# Altium project SDC_V3.0.PrjPcb (part 2 of 2)

## Sheet RS_IF.SchDoc
size 420 x 297 mm; SheetNumber: 6; PageSetup: Record=PageOptions|CenterHorizontal=False|CenterVertical=False|PrintScale=0.95|XCorrection=0.00|YCorrection=0.00|PrintKind=1|BorderSize=5000000|LeftOffset=0|BottomOffset=0|Orientation=1|PaperLength=1000|PaperWidth=1000|Scale=100|PaperSource=15|PrintQuality=600|MediaType=1|DitherType=10|PaperKind=A4|PrintScaleMode=1
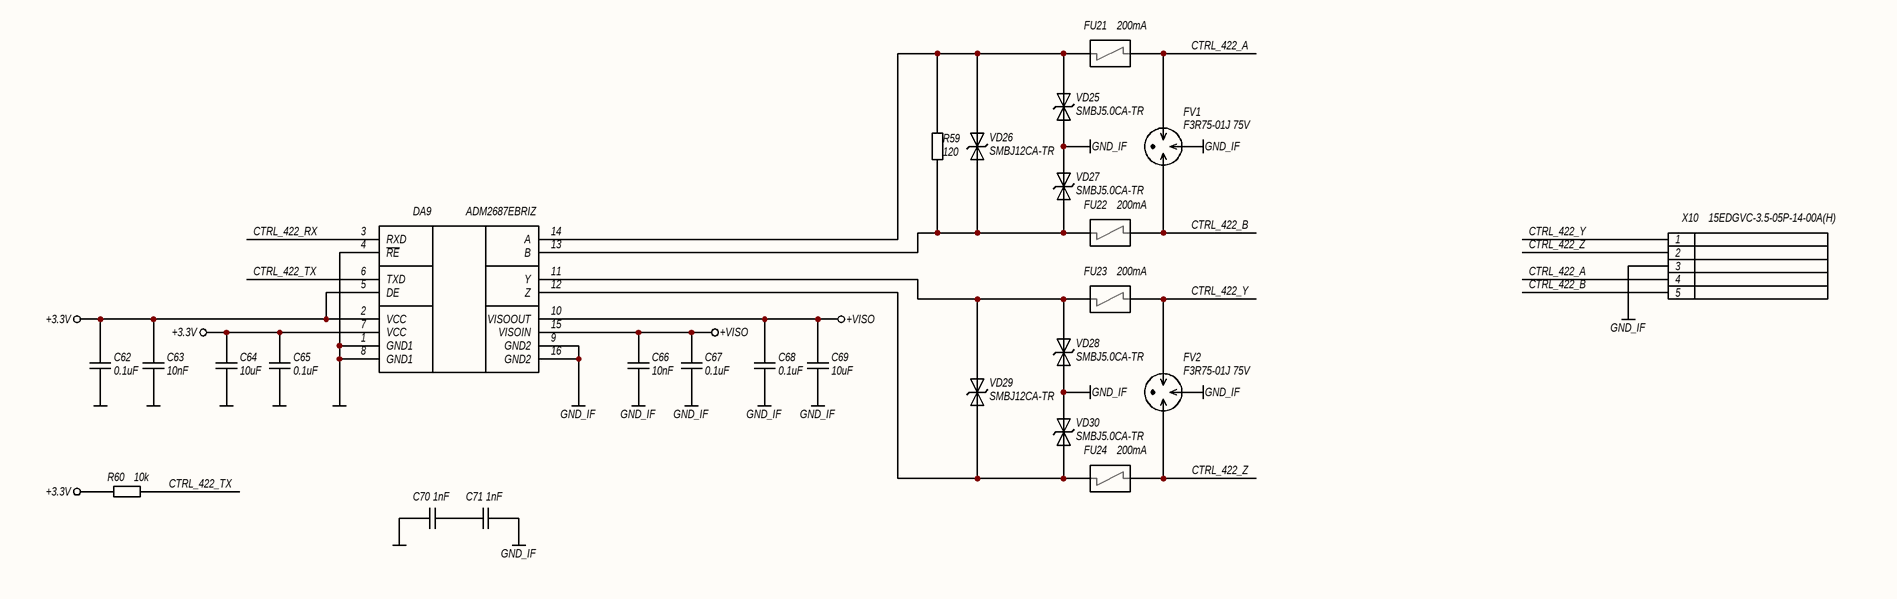
[diagram p5: RS_IF.SchDoc]

### Parts
C62  0.1uF  [C0603N]
C63  10nF  [C0603N]
C64  10uF  [C0805N]
C65  0.1uF  [C0603N]
C66  10nF  [C0603N]
C67  0.1uF  [C0603N]
C68  0.1uF  [C0603N]
C69  10uF  [C0805N]
C70  1nF  [C1808N]
C71  1nF  [C1808N]
DA9  ADM2687EBRIZ  [SOIC16_IC]
FU21  200mA  [TBU-CA]
FU22  200mA  [TBU-CA]
FU23  200mA  [TBU-CA]
FU24  200mA  [TBU-CA]
FV1  F3R75-01J 75V  [GDT_3PIN_B2]
FV2  F3R75-01J 75V  [GDT_3PIN_B2]
R59  120  [R0805N]
R60  10k  [R0603N]
VD25  SMBJ5.0CA-TR  [SMB]
VD26  SMBJ12CA-TR  [SMB]
VD27  SMBJ5.0CA-TR  [SMB]
VD28  SMBJ5.0CA-TR  [SMB]
VD29  SMBJ12CA-TR  [SMB]
VD30  SMBJ5.0CA-TR  [SMB]
X10  15EDGVC-3.5-05P-14-00A(H)  [15EDGVC-3.5-05P-14-00A(H)]

### Nets
+3.3V: C62.2 C63.1 C64.2 C65.2 DA9.2(VCC) DA9.5(DE) DA9.7(VCC) R60.2
+VISO: C66.1 C67.2 C68.2 C69.2 DA9.10(VISOOUT) DA9.15(VISOIN)
GND: C62.1 C63.2 C64.1 C65.1 C70.2 DA9.1(GND1) DA9.4(~{RE}) DA9.8(GND1)
GND_IF: C66.2 C67.1 C68.1 C69.1 C71.1 DA9.9(GND2) DA9.16(GND2) FV1.2 FV2.2 VD25.2(A2) VD27.2(A2) VD28.2(A2) VD30.2(A2) X10.3
CTRL_422_A: FU21.3(IN/OUT) FV1.1 X10.4
CTRL_422_B: FU22.3(IN/OUT) FV1.3 X10.5
CTRL_422_RX: DA9.3(RXD)
CTRL_422_TX: DA9.6(TXD) R60.1
CTRL_422_Y: FU23.3(IN/OUT) FV2.1 X10.1
CTRL_422_Z: FU24.3(IN/OUT) FV2.3 X10.2
NetC70_1: C70.1 C71.2
NetDA9_11: DA9.11(Y) FU23.1(IN/OUT) VD28.1(A1) VD29.1(A1)
NetDA9_12: DA9.12(Z) FU24.1(IN/OUT) VD29.2(A2) VD30.1(A1)
NetDA9_13: DA9.13(B) FU22.1(IN/OUT) R59.2 VD26.2(A2) VD27.1(A1)
NetDA9_14: DA9.14(A) FU21.1(IN/OUT) R59.1 VD25.1(A1) VD26.1(A1)

### Notes on the sheet
- Подп. и дата
- Инв. № дубл.
- Взам. инв. №
- Инв. № подл.
- Лист
- Изм.
- № докум.
- Подп.
- Дата
- Копировал
- Формат А3

### Library data of the parts
C62 C65 C67 C68 = CL10B104KB8NNNC: as C3 on sheet MCU; Артикул: CL10B104KB8NNNC; Номинал: 0.1uF; Строка для документации: https://mm.digikey.com/Volume0/opasdata/d220001/medias/docus/609/CL10B104KB8NNNC_Spec.pdf; Тип элемента: Конденсатор
C63 C66 = CL10B103KB8NNNC: as C29 on sheet DRIVER_A; Артикул: CL10B103KB8NNNC; Номинал: 10nF; Строка для документации: https://mm.digikey.com/Volume0/opasdata/d220001/medias/docus/609/CL10B103KB8NNNC_Spec.pdf; Тип элемента: Конденсатор
C64 C69 = CL21A106KAYNNNE: Конденсатор; Точность: 10%; Напряжение: 25V; Диэлектрик: X5R; Производитель: Samsung Electro-Mechanics; Описание: 10 µF ±10% 25V Ceramic Capacitor X5R 0805 (2012 Metric); Корпус: 0805 (2012 Metric); Температурный диапазон: -55°C ~ 85°C; Вид монтажа: SMD; Артикул: CL21A106KAYNNNE; Номинал: 10uF; Строка для документации: https://mm.digikey.com/Volume0/opasdata/d220001/medias/docus/5545/CL21A106KAYNNNE%20Spec.pdf; Тип элемента: Конденсатор
C70 C71 = GA342DR7GF102KW02L: Конденсатор; Точность: 10%; Напряжение: 250VAC; Диэлектрик: X7R; Производитель: Murata Electronics; Описание: 1000 pF ±10% 250VAC Ceramic Capacitor X7R 1808 (4520 Metric); Корпус: 1808 (4520 Metric); Температурный диапазон: -55°C ~ 125°C; Вид монтажа: SMD; Артикул: GA342DR7GF102KW02L; Номинал: 1nF; Строка для документации: https://search.murata.co.jp/Ceramy/image/img/A01X/G101/ENG/GA342DR7GF102KW02-01.pdf; Тип элемента: Конденсатор
DA9 = ADM2687EBRIZ: Микросхема интерфейса RS485; Производитель: Analog Devices Inc.; Описание: RS422, RS485 Digital Isolator 5000Vrms 3 Channel 500kbps 25kV/µs CMTI 16-SOIC (0.295", 7.50mm Width); Корпус: 16-SOIC (0.295", 7.50mm Width); Температурный диапазон: -40°C ~ 85°C; Вид монтажа: SMD; Артикул: ADM2687EBRIZ; Строка для документации: https://www.analog.com/media/en/technical-documentation/data-sheets/ADM2682E_2687E.pdf; Тип элемента: Микросхема
FU21-FU24 = TBU-CA065-200-WH: Полупроводниковый предохранитель; Напряжение: 650V; Тип: Surge Suppression IС; Производитель: Bourns Inc.; Описание: SURGE SUPP TBU 200MA 650VIMP SMD; Корпус: 6.50mm x 4.00mm; Температурный диапазон: -55°C ~ 125°C; Вид монтажа: SMD; Артикул: TBU-CA065-200-WH; Ток: 200mA; Строка для документации: https://www.bourns.com/docs/Product-Datasheets/TBU-CA.pdf; Тип элемента: Предохранитель
FV1 FV2 = F3R75-01J 75V: Газовый разрядник, трехвыводный; Ток: 10kA; Тип: Gas Discharge Tube Arresters (GDT); Производитель: ZF; Описание: Gas Discharge Tube 75 V 10000A (10kA) ±25% 3 Pole Through Hole Mount; Корпус: 11.5mm x 7.5mm dia.; Вид монтажа: Through hole; Артикул: F3R75-01J 75V; Напряжение пробоя: 75V; Строка для документации: http://nbruitian.com/show.asp?id=1412; Тип элемента: Газовый разрядник
R59 = RC0805FR-07120RL: Резистор; Точность: 1%; ТКС: ±100ppm/°C; Напряжение: 150V; Производитель: YAGEO; Описание: 120 Ohms ±1% 0.125W, 1/8W Chip Resistor 0805 (2012 Metric) Moisture Resistant Thick Film; Корпус: 0805 (2012 Metric); Температурный диапазон: -55°C ~ 155°C; Вид монтажа: SMD; Артикул: RC0805FR-07120RL; Номинал: 120; Строка для документации: https://www.yageo.com/upload/media/product/productsearch/datasheet/rchip/PYu-RC_Group_51_RoHS_L_12.pdf; Тип элемента: Резистор
R60 = RC0603FR-0710KL: as R4 on sheet MCU; Артикул: RC0603FR-0710KL; Номинал: 10k; Строка для документации: https://www.yageo.com/upload/media/product/app/datasheet/rchip/pyu-rc_group_51_rohs_l.pdf; Тип элемента: Резистор
VD25 VD27 VD28 VD30 = SMBJ5.0CA-TR: TVS диод двунаправленный; Напряжение: 5V; Напряжение ограничения: 9.2V; Напряжение пробоя: 6.4V; Ток: 68A; Тип: TVS Bidirectional; Производитель: STMicroelectronics; Описание: 9.2V Clamp 68A Ipp Tvs Diode Surface Mount SMB (DO-214AA); Корпус: DO-214AA, SMB; Температурный диапазон: -55°C ~ 150°C (TJ); Вид монтажа: SMD; Тип элемента: Диод защитный; Артикул: SMBJ5.0CA-TR; Строка для документации: https://www.st.com/content/ccc/resource/technical/document/datasheet/19/78/91/39/07/cd/40/65/CD00001366.pdf/files/CD00001366.pdf/_jcr_content/translations/en.CD00001366.pdf
VD26 VD29 = SMBJ12CA-TR: TVS диод двунаправленный; Напряжение: 12V; Напряжение ограничения: 19.9V; Напряжение пробоя: 13.3V; Ток: 31A; Тип: TVS Bidirectional; Производитель: STMicroelectronics; Описание: 19.9V Clamp 31A Ipp Tvs Diode Surface Mount SMB (DO-214AA); Корпус: DO-214AA, SMB; Температурный диапазон: -55°C ~ 150°C (TJ); Вид монтажа: SMD; Тип элемента: Диод защитный; Артикул: SMBJ12CA-TR; Строка для документации: https://www.st.com/content/ccc/resource/technical/document/datasheet/19/78/91/39/07/cd/40/65/CD00001366.pdf/files/CD00001366.pdf/_jcr_content/translations/en.CD00001366.pdf
X10 = 15EDGVC-3.5-05P-14-00A(H): Разъем, 5 контактов; Тип разъема: Pluggable terminal block; Количество контактов: 5; Шаг контактов: 3.5mm; Ток: 7A; Напряжение: 250V; Производитель: Degson Electronics; Описание: Pluggable terminal block; 3.5mm; ways: 5; straight; socket; male; Температурный диапазон: -40°C ~ 105°C; Вид монтажа: Through Hole; Артикул: 15EDGVC-3.5-05P-14-00A(H); Строка для документации: https://www.tme.eu/Document/83e7173fe653a2d0e44585e87978945b/opr014R8.pdf; Тип элемента: Разъем

## Sheet POWER.SchDoc
size 420 x 297 mm; SheetNumber: 7; PageSetup: Record=PageOptions|CenterHorizontal=False|CenterVertical=False|PrintScale=0.95|XCorrection=0.00|YCorrection=0.00|PrintKind=1|BorderSize=5000000|LeftOffset=0|BottomOffset=0|Orientation=1|PaperLength=1000|PaperWidth=1000|Scale=100|PaperSource=15|PrintQuality=600|MediaType=1|DitherType=10|PaperKind=A4|PrintScaleMode=1
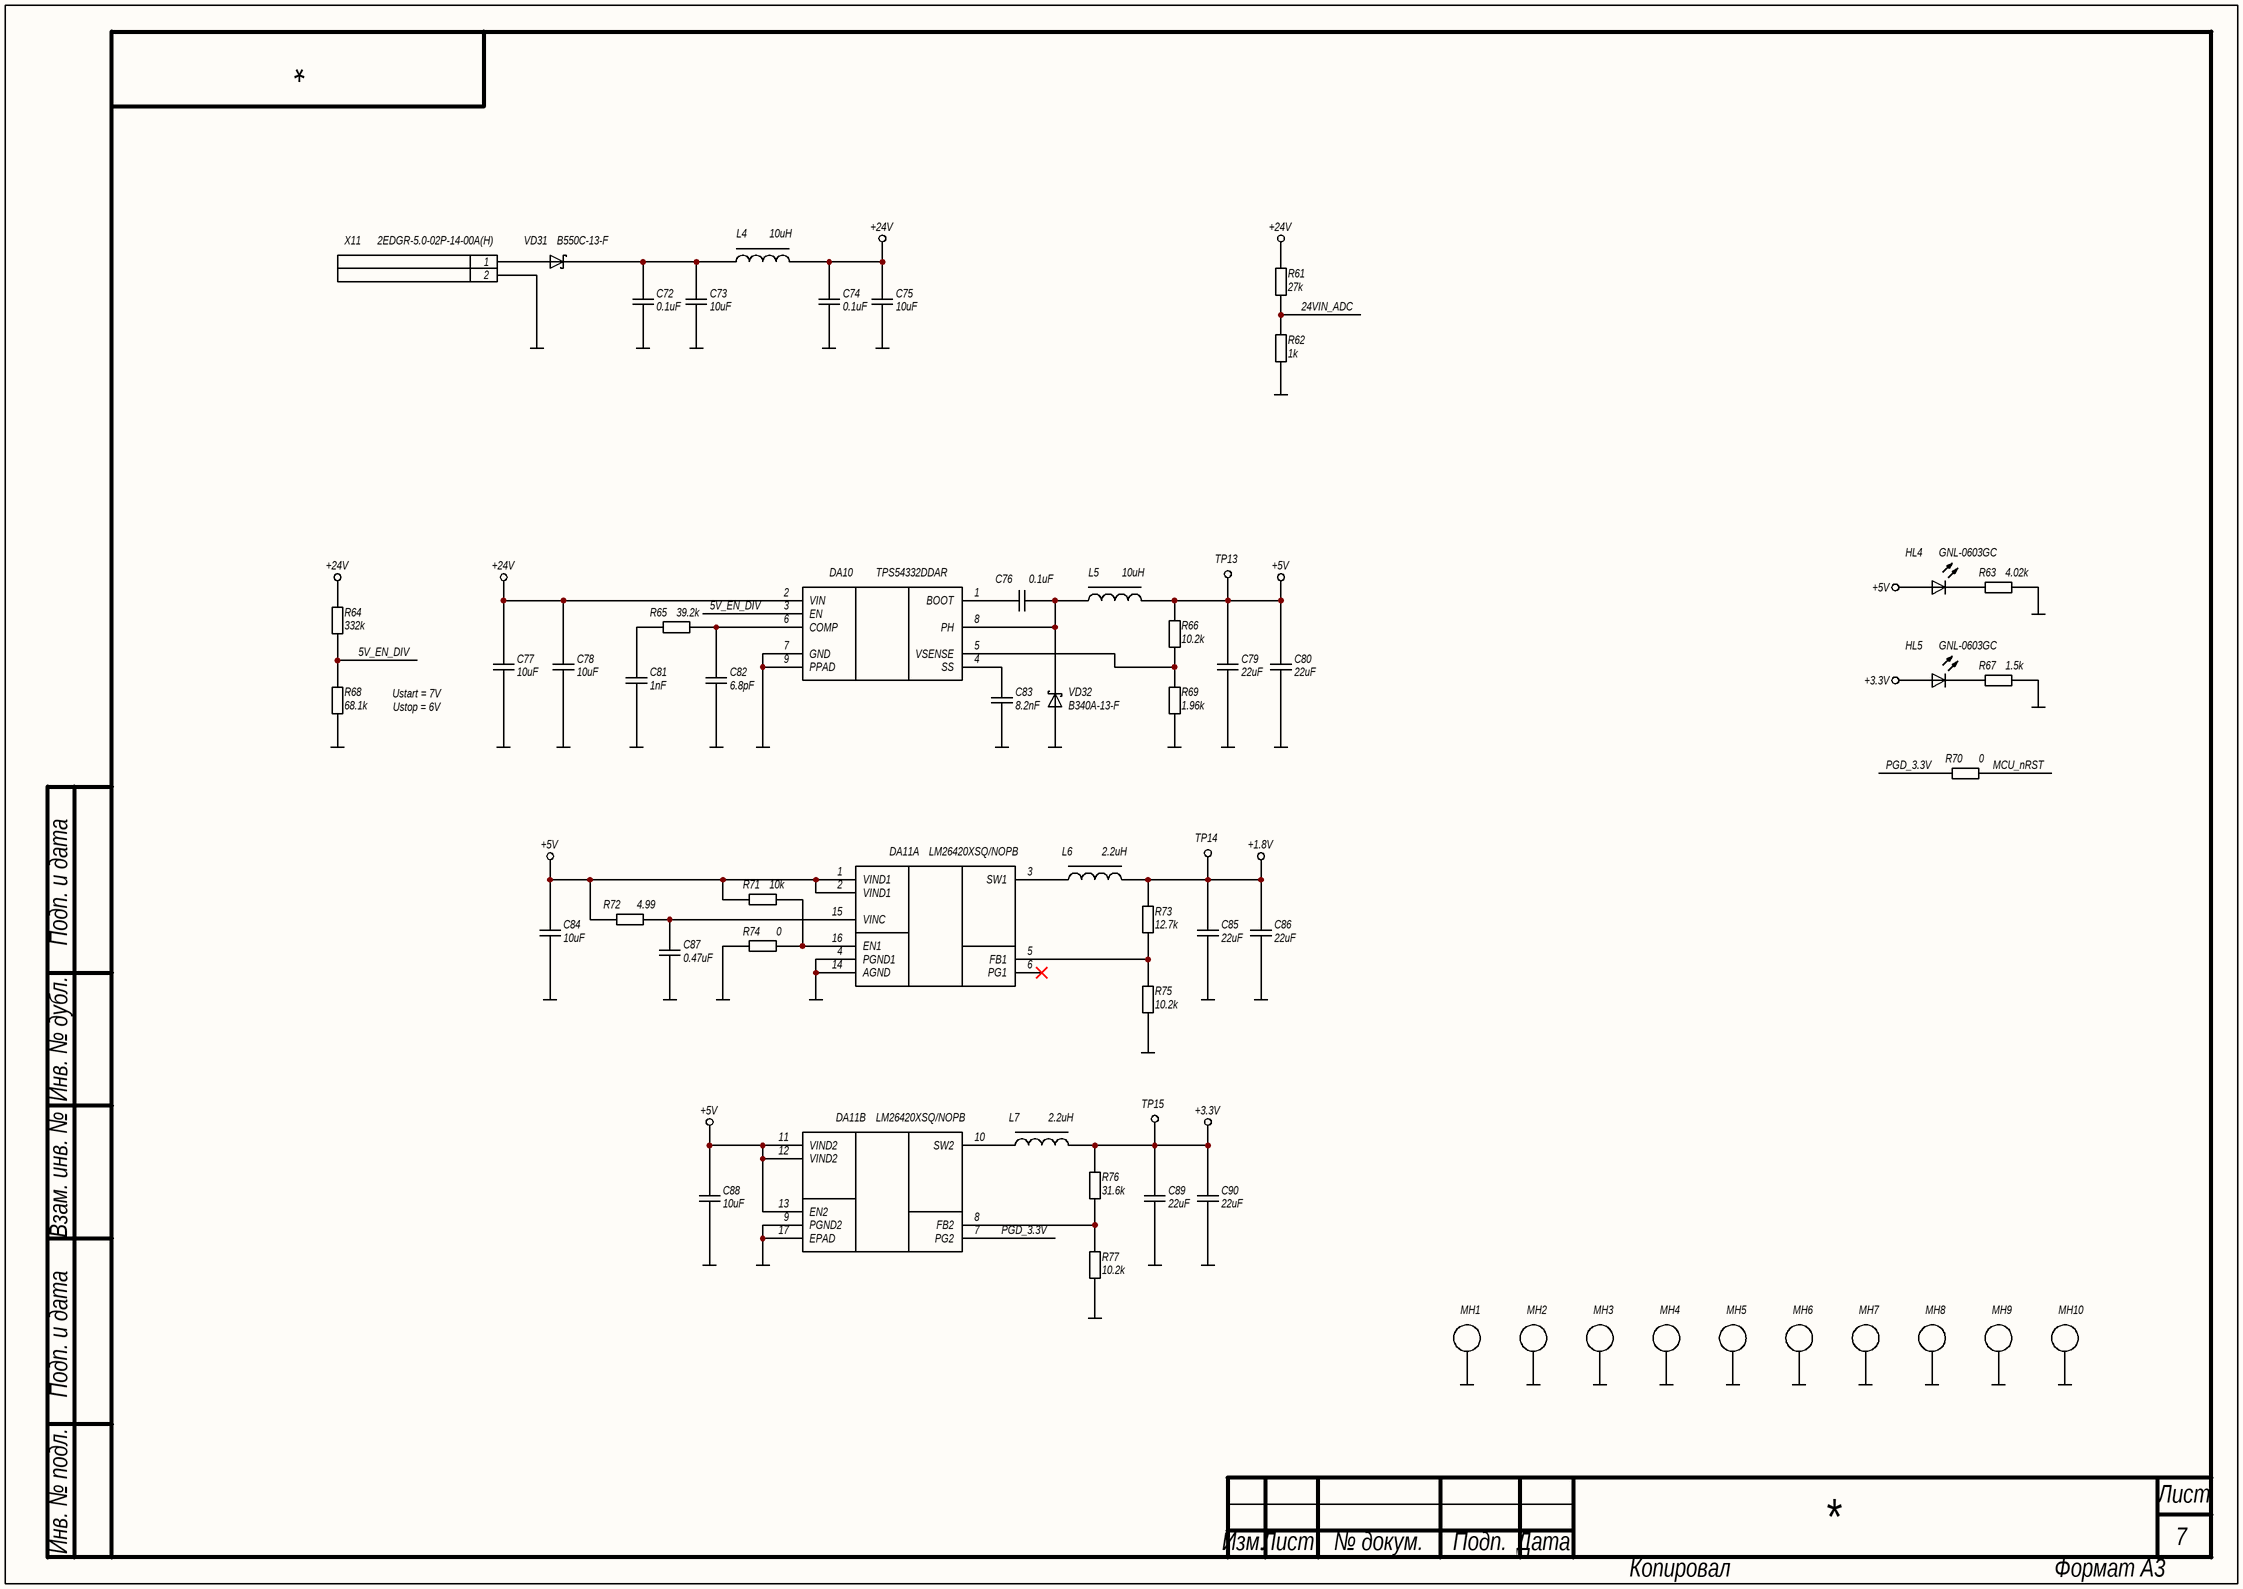
[diagram p6: POWER.SchDoc]

### Parts
C72  0.1uF  [C0805N]
C73  10uF  [C1206N]
C74  0.1uF  [C0805N]
C75  10uF  [C1206N]
C76  0.1uF  [C0603N]
C77  10uF  [C1206N]
C78  10uF  [C1206N]
C79  22uF  [C0805N]
C80  22uF  [C0805N]
C81  1nF  [C0603N]
C82  6.8pF  [C0603N]
C83  8.2nF  [C0603N]
C84  10uF  [C0805N]
C85  22uF  [C0805N]
C86  22uF  [C0805N]
C87  0.47uF  [C0603N]
C88  10uF  [C0805N]
C89  22uF  [C0805N]
C90  22uF  [C0805N]
DA10  TPS54332DDAR  [SOIC8-EP]
DA11  LM26420XSQ/NOPB  [RUM0016A]  (parts A,B of 2)
HL4  GNL-0603GC  [LED0603]
HL5  GNL-0603GC  [LED0603]
L4  10uH  [SRN8040]
L5  10uH  [SRN8040]
L6  2.2uH  [VLS3012HBX]
L7  2.2uH  [VLS3012HBX]
MH1  MNT_HOLE_PL  [MH_3.2_5.4_PLATED_VIA]  (value not drawn)  (no BOM)
MH2  MNT_HOLE_PL  [MH_3.2_5.4_PLATED_VIA]  (value not drawn)  (no BOM)
MH3  MNT_HOLE_PL  [MH_3.2_5.4_PLATED_VIA]  (value not drawn)  (no BOM)
MH4  MNT_HOLE_PL  [MH_3.2_5.4_PLATED_VIA]  (value not drawn)  (no BOM)
MH5  MNT_HOLE_PL  [MH_3.2_5.4_PLATED_VIA]  (value not drawn)  (no BOM)
MH6  MNT_HOLE_PL  [MH_3.2_5.4_PLATED_VIA]  (value not drawn)  (no BOM)
MH7  MNT_HOLE_PL  [MH_3.2_5.4_PLATED_VIA]  (value not drawn)  (no BOM)
MH8  MNT_HOLE_PL  [MH_3.2_5.4_PLATED_VIA]  (value not drawn)  (no BOM)
MH9  MNT_HOLE_PL  [MH_3.2_5.4_PLATED_VIA]  (value not drawn)  (no BOM)
MH10  MNT_HOLE_PL  [MH_3.2_5.4_PLATED_VIA]  (value not drawn)  (no BOM)
R61  27k  [R0603N]
R62  1k  [R0603N]
R63  4.02k  [R0603N]
R64  332k  [R0603N]
R65  39.2k  [R0603N]
R66  10.2k  [R0603N]
R67  1.5k  [R0603N]
R68  68.1k  [R0603N]
R69  1.96k  [R0603N]
R70  0  [R0603N]
R71  10k  [R0603N]
R72  4.99  [R0603N]
R73  12.7k  [R0603N]
R74  0  [R0603N]
R75  10.2k  [R0603N]
R76  31.6k  [R0603N]
R77  10.2k  [R0603N]
TP13  TEST_POINT  [TP_RPAD_0.8MM]  (value not drawn)  (no BOM)
TP14  TEST_POINT  [TP_RPAD_0.8MM]  (value not drawn)  (no BOM)
TP15  TEST_POINT  [TP_RPAD_0.8MM]  (value not drawn)  (no BOM)
VD31  B550C-13-F  [SMC]
VD32  B340A-13-F  [SMA]
X11  2EDGR-5.0-02P-14-00A(H)  [2EDGR-5.0-02P-14-00A(H)]

### Nets
+1.8V: C85.2 C86.2 L6.2 R73.1 TP14.1
+3.3V: C89.2 C90.2 HL5.2(A) L7.2 R76.1 TP15.1
+5V: C79.2 C80.2 C84.2 C88.2 DA11.1(VIND1) DA11.2(VIND1) DA11.11(VIND2) DA11.12(VIND2) DA11.13(EN2) HL4.2(A) L5.2 R66.1 R71.2 R72.2 TP13.1
+24V: C74.2 C75.2 C77.2 C78.2 DA10.2(VIN) L4.2 R61.2 R64.1
GND: C72.1 C73.1 C74.1 C75.1 C77.1 C78.1 C79.1 C80.1 C81.1 C82.1 C83.1 C84.1 C85.1 C86.1 C87.1 C88.1 C89.1 C90.1 DA10.7(GND) DA10.9(PPAD) DA11.4(PGND1) DA11.9(PGND2) DA11.14(AGND) DA11.17(EPAD) MH1.1 MH2.1 MH3.1 MH4.1 MH5.1 MH6.1 MH7.1 MH8.1 MH9.1 MH10.1 R62.1 R63.1 R67.1 R68.2 R69.2 R74.2 R75.2 R77.2 VD32.2(A) X11.2
5V_EN_DIV: DA10.3(EN) R64.2 R68.1
24VIN_ADC: R61.1 R62.2
MCU_nRST: R70.2
PGD_3.3V: DA11.7(PG2) R70.1
NetC72_2: C72.2 C73.2 L4.1 VD31.1(K)
NetC76_1: C76.1 DA10.8(PH) L5.1 VD32.1(K)
NetC76_2: C76.2 DA10.1(BOOT)
NetC81_2: C81.2 R65.2
NetC82_2: C82.2 DA10.6(COMP) R65.1
NetC83_2: C83.2 DA10.4(SS)
NetC87_2: C87.2 DA11.15(VINC) R72.1
NetDA10_5: DA10.5(VSENSE) R66.2 R69.1
NetDA11_3: DA11.3(SW1) L6.1
NetDA11_5: DA11.5(FB1) R73.2 R75.1
NetDA11_8: DA11.8(FB2) R76.2 R77.1
NetDA11_10: DA11.10(SW2) L7.1
NetDA11_16: DA11.16(EN1) R71.1 R74.1
NetHL4_1: HL4.1(K) R63.2
NetHL5_1: HL5.1(K) R67.2
NetVD31_2: VD31.2(A) X11.1

Not connected (* = marked no-connect by the designer): DA11 6(PG1)*

### Notes on the sheet
- Ustart = 7V
- Ustop = 6V
- Подп. и дата
- Инв. № дубл.
- Взам. инв. №
- Инв. № подл.
- Лист
- Изм.
- № докум.
- Подп.
- Дата
- Копировал
- Формат А3

### Library data of the parts
C72 C74 = CL21B104KCFNNNE: Конденсатор; Точность: 10%; Напряжение: 100V; Диэлектрик: X7R; Производитель: Samsung Electro-Mechanics; Описание: 0.1 µF ±10% 100V Ceramic Capacitor X7R 0805 (2012 Metric); Корпус: 0805 (2012 Metric); Температурный диапазон: -55°C ~ 125°C; Вид монтажа: SMD; Артикул: CL21B104KCFNNNE; Номинал: 0.1uF; Строка для документации: https://mm.digikey.com/Volume0/opasdata/d220001/medias/docus/893/CL21B104KCFNNNE_Spec.pdf; Тип элемента: Конденсатор
C73 C75 C77 C78 = CL31B106KBHNNNE: Конденсатор; Точность: 10%; Напряжение: 50V; Диэлектрик: X7R; Производитель: Samsung Electro-Mechanics; Описание: 10 µF ±10% 50V Ceramic Capacitor X7R 1206 (3216 Metric); Корпус: 1206 (3216 Metric); Температурный диапазон: -55°C ~ 125°C; Вид монтажа: SMD; Артикул: CL31B106KBHNNNE; Номинал: 10uF; Строка для документации: https://mm.digikey.com/Volume0/opasdata/d220001/medias/docus/41/CL31B106KBHNNNE_Spec.pdf; Тип элемента: Конденсатор
C76 = CL10B104KB8NNNC: Конденсатор; Точность: 10%; Напряжение: 50V; Диэлектрик: X7R; Производитель: Samsung Electro-Mechanics; Описание: 0.1 µF ±10% 50V Ceramic Capacitor X7R 0603 (1608 Metric); Корпус: 0603 (1608 Metric); Температурный диапазон: -55°C ~ 125°C; Вид монтажа: SMD; Артикул: CL10B104KB8NNNC; Номинал: 0.1uF; Строка для документации: https://mm.digikey.com/Volume0/opasdata/d220001/medias/docus/609/CL10B104KB8NNNC_Spec.pdf; Тип элемента: Конденсатор
C79 C80 C85 C86 C89 C90 = CL21A226MOCLRNC: Конденсатор; Точность: 20%; Напряжение: 16V; Диэлектрик: X5R; Производитель: Samsung Electro-Mechanics; Описание: 22 µF ±20% 16V Ceramic Capacitor X5R 0805 (2012 Metric); Корпус: 0805 (2012 Metric); Температурный диапазон: -55°C ~ 85°C; Вид монтажа: SMD; Артикул: CL21A226MOCLRNC; Номинал: 22uF; Строка для документации: https://mm.digikey.com/Volume0/opasdata/d220001/medias/docus/43/CL21A226MOCLRNC_Spec.pdf; Тип элемента: Конденсатор
C81 = CL10B102KC8NNNC: Конденсатор; Точность: 10%; Напряжение: 100V; Диэлектрик: X7R; Производитель: Samsung Electro-Mechanics; Описание: 1000 pF ±10% 100V Ceramic Capacitor X7R 0603 (1608 Metric); Корпус: 0603 (1608 Metric); Температурный диапазон: -55°C ~ 125°C; Вид монтажа: SMD; Артикул: CL10B102KC8NNNC; Номинал: 1nF; Строка для документации: https://mm.digikey.com/Volume0/opasdata/d220001/medias/docus/1136/CL10B102KC8NNNC_Spec.pdf; Тип элемента: Конденсатор
C82 = CC0603CRNPO9BN6R8: Конденсатор; Точность: ±0.25pF; Напряжение: 50V; Диэлектрик: NP0; Производитель: YAGEO; Описание: 6.8 pF ±0.25pF 50V Ceramic Capacitor C0G, NP0 0603 (1608 Metric); Корпус: 0603 (1608 Metric); Температурный диапазон: -55°C ~ 125°C; Вид монтажа: SMD; Артикул: CC0603CRNPO9BN6R8; Номинал: 6.8pF; Строка для документации: https://www.yageo.com/upload/media/product/productsearch/datasheet/mlcc/UPY-GP_NP0_16V-to-50V_18.pdf; Тип элемента: Конденсатор
C83 = CC0603KRX7R9BB822: Конденсатор; Точность: 10%; Напряжение: 50V; Диэлектрик: X7R; Производитель: YAGEO; Описание: 8200 pF ±10% 50V Ceramic Capacitor X7R 0603 (1608 Metric); Корпус: 0603 (1608 Metric); Температурный диапазон: -55°C ~ 125°C; Вид монтажа: SMD; Артикул: CC0603KRX7R9BB822; Номинал: 8.2nF; Строка для документации: https://www.yageo.com/upload/media/product/productsearch/datasheet/mlcc/UPY-GPHC_X7R_6.3V-to-250V_23.pdf; Тип элемента: Конденсатор
C84 C88 = CL21A106KAYNNNE: Конденсатор; Точность: 10%; Напряжение: 25V; Диэлектрик: X5R; Производитель: Samsung Electro-Mechanics; Описание: 10 µF ±10% 25V Ceramic Capacitor X5R 0805 (2012 Metric); Корпус: 0805 (2012 Metric); Температурный диапазон: -55°C ~ 85°C; Вид монтажа: SMD; Артикул: CL21A106KAYNNNE; Номинал: 10uF; Строка для документации: https://mm.digikey.com/Volume0/opasdata/d220001/medias/docus/5545/CL21A106KAYNNNE%20Spec.pdf; Тип элемента: Конденсатор
C87 = CL10B474KA8NNNC: Конденсатор; Точность: 10%; Напряжение: 25V; Диэлектрик: X7R; Производитель: Samsung Electro-Mechanics; Описание: 0.47 µF ±10% 25V Ceramic Capacitor X7R 0603 (1608 Metric); Корпус: 0603 (1608 Metric); Температурный диапазон: -55°C ~ 125°C; Вид монтажа: SMD; Артикул: CL10B474KA8NNNC; Номинал: 0.47uF; Строка для документации: https://mm.digikey.com/Volume0/opasdata/d220001/medias/docus/41/CL10B474KA8NNNC_Spec.pdf; Тип элемента: Конденсатор
DA10 = TPS54332DDAR: Микросхема понижающего преобразователя; Производитель: Texas Instruments; Описание: Buck Switching Regulator IC Positive Adjustable 0.8V 1 Output 3.5A 8-PowerSOIC (0.154", 3.90mm Width); Корпус: 8-PowerSOIC (0.154", 3.90mm Width); Температурный диапазон: -40°C ~ 150°C (TJ); Вид монтажа: SMD; Артикул: TPS54332DDAR; Строка для документации: https://www.ti.com/lit/ds/symlink/tps54332.pdf; Тип элемента: Микросхема
DA11 = LM26420XSQ/NOPB: Производитель: Texas Instruments; Описание: Buck Switching Regulator IC Positive Adjustable 0.8V 2 Output 2A 16-WQFN Exposed Pad; Корпус: 16-WQFN (4x4); Температурный диапазон: -40°C ~ 125°C (TJ); Вид монтажа: SMD; Тип элемента: Микросхема; Артикул: LM26420XSQ/NOPB; Строка для документации: https://www.ti.com/lit/ds/symlink/lm26420.pdf
HL4 HL5 = GNL-0603GC: Светодиод; Прямой ток: 20mA; Напряжение: 2V; Яркость: 12mcd; Цвет: Зеленый; Длина волны: 567nm; Производитель: G-nor Electronics; Описание: Green 567nm LED Indication - Discrete 2V 0603 (1608 Metric); Корпус: 0603 (1608 Metric); Температурный диапазон: -40°C ~ 80°C; Вид монтажа: SMD; Тип элемента: Диод светоизлучающий; Артикул: GNL-0603GC; Строка для документации: https://www.g-nor.com/Uploads/Ed/file/20210517/1621223120713818.doc
L4 L5 = SRN8040-100M: Дроссель с магнитопроводом; Точность: 20%; Ток номинальный: 3.1A; Ток насыщения: 3.4A; Сопротивление: 50m; Производитель: Bourns Inc.; Описание: 15 µH Semi-Shielded Drum Core, Wirewound Inductor 2.4 A 70mOhm Max Nonstandard; Корпус: 8.00mm x 8.00mm; Температурный диапазон: -40°C ~ 125°C; Вид монтажа: SMD; Артикул: SRN8040-100M; Номинал: 10uH; Строка для документации: https://www.bourns.com/docs/Product-Datasheets/SRN8040.pdf; Тип элемента: Дроссель
L6 L7 = VLS3012HBX-2R2M: Дроссель с магнитопроводом; Точность: 20%; Ток номинальный: 3.15A; Ток насыщения: 3.35A; Сопротивление: 106m; Производитель: TDK Corporation; Описание: 2.2 µH Shielded Drum Core, Wirewound Inductor 3.15 A 106mOhm Max Nonstandard; Корпус: 3.00mm x 3.00mm; Температурный диапазон: -40°C ~ 105°C; Вид монтажа: SMD; Артикул: VLS3012HBX-2R2M; Номинал: 2.2uH; Строка для документации: https://product.tdk.com/en/system/files?file=dam/doc/product/inductor/inductor/smd/catalog/inductor_commercial_power_vls3012hbx_en.pdf; Тип элемента: Дроссель
MH1-MH10 = Mounting Hole, 3.2mm/5.4mm, plated, with via stiching: Монтажное отверстие, металлизированное; Тип элемента: Механический; Артикул: Mounting Hole, 3.2mm/5.4mm, plated, with via stiching; Описание: Mounting Hole, 3.2mm/5.4mm , plated, with via stiching; Тип: Mounting Hole
R61 = RC0603FR-0727KL: Резистор; Точность: 1%; ТКС: ±100ppm/°C; Напряжение: 75V; Производитель: YAGEO; Описание: 27 kOhms Jumper Chip Resistor 0603 (1608 Metric) Moisture Resistant Thick Film; Корпус: 0603 (1608 Metric); Температурный диапазон: -55°C ~ 155°C; Вид монтажа: SMD; Артикул: RC0603FR-0727KL; Номинал: 27k; Строка для документации: https://www.yageo.com/upload/media/product/app/datasheet/rchip/pyu-rc_group_51_rohs_l.pdf; Тип элемента: Резистор
R62 = RC0603FR-071KL: Резистор; Точность: 1%; ТКС: ±100ppm/°C; Напряжение: 75V; Производитель: YAGEO; Описание: 1 kOhms ±1% 0.1W, 1/10W Chip Resistor 0603 (1608 Metric) Moisture Resistant Thick Film; Корпус: 0603 (1608 Metric); Температурный диапазон: -55°C ~ 155°C; Вид монтажа: SMD; Артикул: RC0603FR-071KL; Номинал: 1k; Строка для документации: https://www.yageo.com/upload/media/product/app/datasheet/rchip/pyu-rc_group_51_rohs_l.pdf; Тип элемента: Резистор
R63 = RC0603FR-074K02L: Резистор; Точность: 1%; ТКС: ±100ppm/°C; Напряжение: 75V; Производитель: YAGEO; Описание: 4.02 kOhms ±1% 0.1W, 1/10W Chip Resistor 0603 (1608 Metric) Moisture Resistant Thick Film; Корпус: 0603 (1608 Metric); Температурный диапазон: -55°C ~ 155°C; Вид монтажа: SMD; Артикул: RC0603FR-074K02L; Номинал: 4.02k; Строка для документации: https://www.yageo.com/upload/media/product/app/datasheet/rchip/pyu-rc_group_51_rohs_l.pdf; Тип элемента: Резистор
R64 = RC0603FR-07332KL: Резистор; Точность: 1%; ТКС: ±100ppm/°C; Напряжение: 75V; Производитель: YAGEO; Описание: 332 kOhms ±1% 0.1W, 1/10W Chip Resistor 0603 (1608 Metric) Moisture Resistant Thick Film; Корпус: 0603 (1608 Metric); Температурный диапазон: -55°C ~ 155°C; Вид монтажа: SMD; Артикул: RC0603FR-07332KL; Номинал: 332k; Строка для документации: https://www.yageo.com/upload/media/product/app/datasheet/rchip/pyu-rc_group_51_rohs_l.pdf; Тип элемента: Резистор
R65 = RC0603FR-0739K2L: Резистор; Точность: 1%; ТКС: ±100ppm/°C; Напряжение: 75V; Производитель: YAGEO; Описание: 39.2 kOhms ±1% 0.1W, 1/10W Chip Resistor 0603 (1608 Metric) Moisture Resistant Thick Film; Корпус: 0603 (1608 Metric); Температурный диапазон: -55°C ~ 155°C; Вид монтажа: SMD; Артикул: RC0603FR-0739K2L; Номинал: 39.2k; Строка для документации: https://www.yageo.com/upload/media/product/app/datasheet/rchip/pyu-rc_group_51_rohs_l.pdf; Тип элемента: Резистор
R66 R75 R77 = RC0603FR-0710K2L: Резистор; Точность: 1%; ТКС: ±100ppm/°C; Напряжение: 75V; Производитель: YAGEO; Описание: 10.2 kOhms ±1% 0.1W, 1/10W Chip Resistor 0603 (1608 Metric) Moisture Resistant Thick Film; Корпус: 0603 (1608 Metric); Температурный диапазон: -55°C ~ 155°C; Вид монтажа: SMD; Артикул: RC0603FR-0710K2L; Номинал: 10.2k; Строка для документации: https://www.yageo.com/upload/media/product/app/datasheet/rchip/pyu-rc_group_51_rohs_l.pdf; Тип элемента: Резистор
R67 = RC0603FR-071K5L: Резистор; Точность: 1%; ТКС: ±100ppm/°C; Напряжение: 75V; Производитель: YAGEO; Описание: 1.5 kOhms ±1% 0.1W, 1/10W Chip Resistor 0603 (1608 Metric) Moisture Resistant Thick Film; Корпус: 0603 (1608 Metric); Температурный диапазон: -55°C ~ 155°C; Вид монтажа: SMD; Артикул: RC0603FR-071K5L; Номинал: 1.5k; Строка для документации: https://www.yageo.com/upload/media/product/app/datasheet/rchip/pyu-rc_group_51_rohs_l.pdf; Тип элемента: Резистор
R68 = RC0603FR-0768K1L: Резистор; Точность: 1%; ТКС: ±100ppm/°C; Напряжение: 75V; Производитель: YAGEO; Описание: 68.1 kOhms ±1% 0.1W, 1/10W Chip Resistor 0603 (1608 Metric) Moisture Resistant Thick Film; Корпус: 0603 (1608 Metric); Температурный диапазон: -55°C ~ 155°C; Вид монтажа: SMD; Артикул: RC0603FR-0768K1L; Номинал: 68.1k; Строка для документации: https://www.yageo.com/upload/media/product/app/datasheet/rchip/pyu-rc_group_51_rohs_l.pdf; Тип элемента: Резистор
R69 = RC0603FR-071K96L: Резистор; Точность: 1%; ТКС: ±100ppm/°C; Напряжение: 75V; Производитель: YAGEO; Описание: 1.96 kOhms ±1% 0.1W, 1/10W Chip Resistor 0603 (1608 Metric) Moisture Resistant Thick Film; Корпус: 0603 (1608 Metric); Температурный диапазон: -55°C ~ 155°C; Вид монтажа: SMD; Артикул: RC0603FR-071K96L; Номинал: 1.96k; Строка для документации: https://www.yageo.com/upload/media/product/app/datasheet/rchip/pyu-rc_group_51_rohs_l.pdf; Тип элемента: Резистор
R70 R74 = RC0603FR-070RL: Резистор; Точность: 1%; ТКС: ±100ppm/°C; Напряжение: 75V; Производитель: YAGEO; Описание: 0 Ohms Jumper Chip Resistor 0603 (1608 Metric) Moisture Resistant Thick Film; Корпус: 0603 (1608 Metric); Температурный диапазон: -55°C ~ 155°C; Вид монтажа: SMD; Артикул: RC0603FR-070RL; Номинал: 0; Строка для документации: https://www.yageo.com/upload/media/product/app/datasheet/rchip/pyu-rc_group_51_rohs_l.pdf; Тип элемента: Резистор
R71 = RC0603FR-0710KL: Резистор; Точность: 1%; ТКС: ±100ppm/°C; Напряжение: 75V; Производитель: YAGEO; Описание: 10 kOhms ±1% 0.1W, 1/10W Chip Resistor 0603 (1608 Metric) Moisture Resistant Thick Film; Корпус: 0603 (1608 Metric); Температурный диапазон: -55°C ~ 155°C; Вид монтажа: SMD; Артикул: RC0603FR-0710KL; Номинал: 10k; Строка для документации: https://www.yageo.com/upload/media/product/app/datasheet/rchip/pyu-rc_group_51_rohs_l.pdf; Тип элемента: Резистор
R72 = RC0603FR-074R99L: Резистор; Точность: 1%; ТКС: ±100ppm/°C; Напряжение: 75V; Производитель: YAGEO; Описание: 4.99 Ohms ±1% 0.1W, 1/10W Chip Resistor 0603 (1608 Metric) Moisture Resistant Thick Film; Корпус: 0603 (1608 Metric); Температурный диапазон: -55°C ~ 155°C; Вид монтажа: SMD; Артикул: RC0603FR-074R99L; Номинал: 4.99; Строка для документации: https://www.yageo.com/upload/media/product/app/datasheet/rchip/pyu-rc_group_51_rohs_l.pdf; Тип элемента: Резистор
R73 = RC0603FR-0712K7L: Резистор; Точность: 1%; ТКС: ±100ppm/°C; Напряжение: 75V; Производитель: YAGEO; Описание: 12.7 kOhms ±1% 0.1W, 1/10W Chip Resistor 0603 (1608 Metric) Moisture Resistant Thick Film; Корпус: 0603 (1608 Metric); Температурный диапазон: -55°C ~ 155°C; Вид монтажа: SMD; Артикул: RC0603FR-0712K7L; Номинал: 12.7k; Строка для документации: https://www.yageo.com/upload/media/product/app/datasheet/rchip/pyu-rc_group_51_rohs_l.pdf; Тип элемента: Резистор
R76 = RC0603FR-0731K6L: Резистор; Точность: 1%; ТКС: ±100ppm/°C; Напряжение: 75V; Производитель: YAGEO; Описание: 31.6 kOhms ±1% 0.1W, 1/10W Chip Resistor 0603 (1608 Metric) Moisture Resistant Thick Film; Корпус: 0603 (1608 Metric); Температурный диапазон: -55°C ~ 155°C; Вид монтажа: SMD; Артикул: RC0603FR-0731K6L; Номинал: 31.6k; Строка для документации: https://www.yageo.com/upload/media/product/app/datasheet/rchip/pyu-rc_group_51_rohs_l.pdf; Тип элемента: Резистор
TP13-TP15 = Test Point, Round Pad, 0.8mm diameter: Контрольная точка; Количество контактов: 1; Тип элемента: Разъем; Артикул: Test Point, Round Pad, 0.8mm diameter; Тип разъема: Test Point; Описание: Test Point, Round Pad, 0.8mm diameter
VD31 = B550C-13-F: Диод Шоттки; Прямой ток: 5A; Напряжение: 50V; Производитель: Diodes Incorporated; Описание: Diode 50 V 5A Surface Mount SMC; Корпус: DO-214AB, SMC; Температурный диапазон: -55°C ~ 150°C; Вид монтажа: SMD; Артикул: B550C-13-F; Тип: Schottky; Строка для документации: https://www.diodes.com/assets/Datasheets/B520C-B560C.pdf; Тип элемента: Диод
VD32 = B340A-13-F: Диод Шоттки; Прямой ток: 3A; Напряжение: 40V; Производитель: Diodes Incorporated; Описание: Diode 40 V 3A Surface Mount SMA; Корпус: DO-214AC, SMA; Температурный диапазон: -55°C ~ 150°C; Вид монтажа: SMD; Артикул: B340A-13-F; Тип: Schottky; Строка для документации: https://www.diodes.com/assets/Datasheets/ds30891.pdf; Тип элемента: Диод
X11 = 2EDGR-5.0-02P-14-00A(H): Разъем, 2 контакта; Тип разъема: Pluggable terminal block; Количество контактов: 2; Шаг контактов: 5mm; Ток: 20A; Напряжение: 320V; Производитель: Degson Electronics; Описание: Pluggable terminal block; 5.0mm; ways: 2; angled 90; socket; male; Температурный диапазон: -40°C ~ 105°C; Вид монтажа: Through Hole; Артикул: 2EDGR-5.0-02P-14-00A(H); Строка для документации: https://www.tme.eu/Document/aee9e19a2094185fa8ff38cbebedb2f3/2EDGR-5.0.pdf; Тип элемента: Разъем

## Sheet EXT_LED.SchDoc: {Наименование}
size 420 x 297 mm; ApprovedBy: {Утвердил}; CheckedBy: {Проверил}; DrawnBy: {Разраб.}; DocumentNumber: АБВГ 123456.789 00; SheetNumber: 8; SheetTotal: {}; Scale: {Мш.}; PageSetup: Record=PageOptions|CenterHorizontal=False|CenterVertical=False|PrintScale=0.95|XCorrection=0.00|YCorrection=0.00|PrintKind=1|BorderSize=5000000|LeftOffset=0|BottomOffset=0|Orientation=1|PaperLength=1000|PaperWidth=1000|Scale=100|PaperSource=15|PrintQuality=600|MediaType=1|DitherType=10|PaperKind=A4|PrintScaleMode=1; ProcessInspection: {Т.контр.}; Mass: {М.}; NormInspection: {Н.контр.}; Letter1Column: {}; Letter2Column: {}; Letter3Column: {}; DocumentType: {Документ}; Rule: PcbType=ProtelPcb
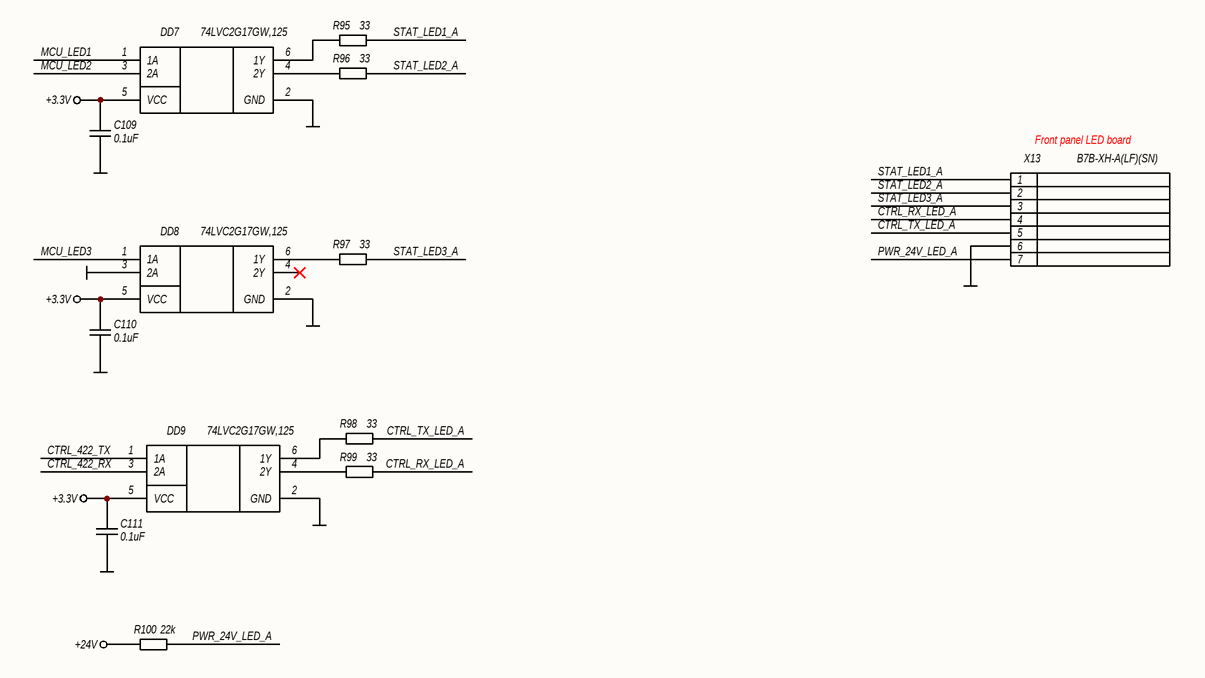
[diagram p7: EXT_LED.SchDoc]

### Parts
C109  0.1uF  [C0603N]
C110  0.1uF  [C0603N]
C111  0.1uF  [C0603N]
DD7  74LVC2G17GW,125  [SOT363-2]
DD8  74LVC2G17GW,125  [SOT363-2]
DD9  74LVC2G17GW,125  [SOT363-2]
R95  33  [R0603N]
R96  33  [R0603N]
R97  33  [R0603N]
R98  33  [R0603N]
R99  33  [R0603N]
R100  22k  [R0603N]
X13  B7B-XH-A(LF)(SN)  [B7B-XH-A]

### Nets
+3.3V: C109.2 C110.2 C111.2 DD7.5(VCC) DD8.5(VCC) DD9.5(VCC)
+24V: R100.2
GND: C109.1 C110.1 C111.1 DD7.2(GND) DD8.2(GND) DD8.3(2A) DD9.2(GND) X13.6
CTRL_422_RX: DD9.3(2A)
CTRL_422_TX: DD9.1(1A)
CTRL_RX_LED_A: R99.2 X13.4
CTRL_TX_LED_A: R98.2 X13.5
MCU_LED1: DD7.1(1A)
MCU_LED2: DD7.3(2A)
MCU_LED3: DD8.1(1A)
PWR_24V_LED_A: R100.1 X13.7
STAT_LED1_A: R95.2 X13.1
STAT_LED2_A: R96.2 X13.2
STAT_LED3_A: R97.2 X13.3
NetDD7_4: DD7.4(2Y) R96.1
NetDD7_6: DD7.6(1Y) R95.1
NetDD8_6: DD8.6(1Y) R97.1
NetDD9_4: DD9.4(2Y) R99.1
NetDD9_6: DD9.6(1Y) R98.1

Not connected (* = marked no-connect by the designer): DD8 4(2Y)*

### Notes on the sheet
- (near X13) Front panel LED board
- Подп. и дата
- Инв. № дубл.
- Взам. инв. №
- Инв. № подл.
- Лист
- Изм.
- № докум.
- Подп.
- Дата
- Копировал
- Формат А3

### Library data of the parts
C109-C111 = CL10B104KB8NNNC: as C76 on sheet POWER; Артикул: CL10B104KB8NNNC; Номинал: 0.1uF; Строка для документации: https://mm.digikey.com/Volume0/opasdata/d220001/medias/docus/609/CL10B104KB8NNNC_Spec.pdf; Тип элемента: Конденсатор
DD7-DD9 = 74LVC2G17GW,125: Микросхема сдвоенный триггер Шмитта; Производитель: Nexperia USA Inc.; Описание: Buffer, Non-Inverting 2 Element 1 Bit per Element Push-Pull Output 6-TSSOP; Корпус: 6-TSSOP; Температурный диапазон: -40°C ~ 125°C (TA); Вид монтажа: SMD; Артикул: 74LVC2G17GW,125; Строка для документации: https://assets.nexperia.com/documents/data-sheet/74LVC2G17.pdf; Тип элемента: Микросхема
R95-R99 = RC0603FR-0733RL: Резистор; Точность: 1%; ТКС: ±100ppm/°C; Напряжение: 75V; Производитель: YAGEO; Описание: 33 Ohms ±1% 0.1W, 1/10W Chip Resistor 0603 (1608 Metric) Moisture Resistant Thick Film; Корпус: 0603 (1608 Metric); Температурный диапазон: -55°C ~ 155°C; Вид монтажа: SMD; Артикул: RC0603FR-0733RL; Номинал: 33; Строка для документации: https://www.yageo.com/upload/media/product/app/datasheet/rchip/pyu-rc_group_51_rohs_l.pdf; Тип элемента: Резистор
R100 = RC0603FR-0722KL: Резистор; Точность: 1%; ТКС: ±100ppm/°C; Напряжение: 75V; Производитель: YAGEO; Описание: 22 kOhms ±1% 0.1W, 1/10W Chip Resistor 0603 (1608 Metric) Moisture Resistant Thick Film; Корпус: 0603 (1608 Metric); Температурный диапазон: -55°C ~ 155°C; Вид монтажа: SMD; Артикул: RC0603FR-0722KL; Номинал: 22k; Строка для документации: https://www.yageo.com/upload/media/product/app/datasheet/rchip/pyu-rc_group_51_rohs_l.pdf; Тип элемента: Резистор
X13 = B7B-XH-A(LF)(SN): Разъем, 7 контактов; Тип разъема: Header, Male Pin; Количество контактов: 7; Шаг контактов: 2.5mm; Ток: 3A; Напряжение: 250V; Производитель: JST Sales America Inc.; Описание: Connector Header Through Hole 7 position 0.098" (2.50mm); Температурный диапазон: -25°C ~ 85°C; Вид монтажа: Through Hole; Артикул: B7B-XH-A(LF)(SN); Строка для документации: https://www.jst-mfg.com/product/pdf/eng/eXH.pdf; Тип элемента: Разъем

## Sheet SNS_INPUT.SchDoc: {Наименование}
size 420 x 297 mm; ApprovedBy: {Утвердил}; CheckedBy: {Проверил}; DrawnBy: {Разраб.}; DocumentNumber: АБВГ 123456.789 00; SheetNumber: 9; SheetTotal: {}; Scale: {Мш.}; PageSetup: Record=PageOptions|CenterHorizontal=False|CenterVertical=False|PrintScale=0.95|XCorrection=0.00|YCorrection=0.00|PrintKind=1|BorderSize=5000000|LeftOffset=0|BottomOffset=0|Orientation=1|PaperLength=1000|PaperWidth=1000|Scale=100|PaperSource=15|PrintQuality=600|MediaType=1|DitherType=10|PaperKind=A4|PrintScaleMode=1; ProcessInspection: {Т.контр.}; Mass: {М.}; NormInspection: {Н.контр.}; Letter1Column: {}; Letter2Column: {}; Letter3Column: {}; DocumentType: {Документ}; Rule: PcbType=ProtelPcb
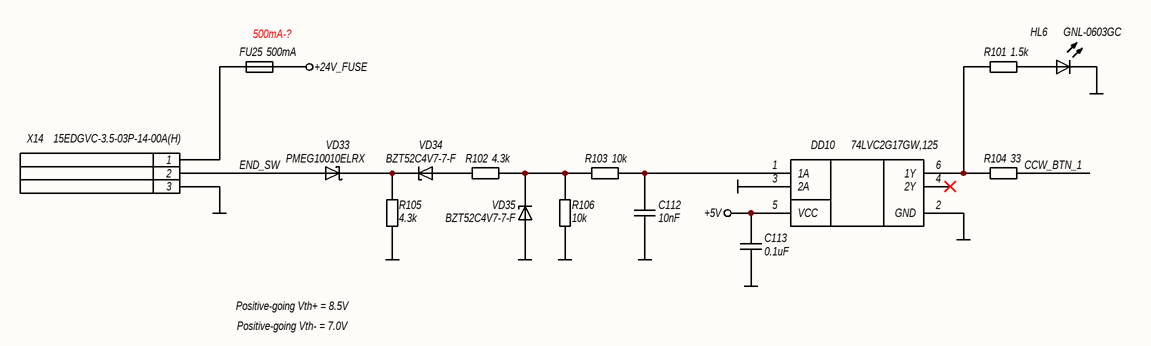
[diagram p8: SNS_INPUT.SchDoc]

### Parts
C112  10nF  [C0603N]
C113  0.1uF  [C0603N]
DD10  74LVC2G17GW,125  [SOT363-2]
FU25  500mA  [MF-MSMF]
HL6  GNL-0603GC  [LED0603]
R101  1.5k  [R0603N]
R102  4.3k  [R1206N]
R103  10k  [R0603N]
R104  33  [R0603N]
R105  4.3k  [R1206N]
R106  10k  [R0603N]
VD33  PMEG10010ELRX  [SOD123W]
VD34  BZT52C4V7-7-F  [SOD123]
VD35  BZT52C4V7-7-F  [SOD123]
X14  15EDGVC-3.5-03P-14-00A(H)  [15EDGVC-3.5-03P-14-00A(H)]

### Nets
+5V: C113.2 DD10.5(VCC)
+24V_FUSE: FU25.2
GND: C112.2 C113.1 DD10.2(GND) DD10.3(2A) HL6.1(K) R105.2 R106.2 VD35.2(A) X14.3
CCW_BTN_1: R104.1
END_SW: VD33.2(A) X14.2
NetC112_1: C112.1 DD10.1(1A) R103.1
NetDD10_6: DD10.6(1Y) R101.2 R104.2
NetFU25_1: FU25.1 X14.1
NetHL6_2: HL6.2(A) R101.1
NetR102_1: R102.1 R103.2 R106.1 VD35.1(K)
NetR102_2: R102.2 VD34.2(A)
NetR105_1: R105.1 VD33.1(K) VD34.1(K)

Not connected (* = marked no-connect by the designer): DD10 4(2Y)*

### Notes on the sheet
- (near FU25) 500mA-?
- Positive-going Vth+ = 8.5V
- Positive-going Vth- = 7.0V
- Подп. и дата
- Инв. № дубл.
- Взам. инв. №
- Инв. № подл.
- Лист
- Изм.
- № докум.
- Подп.
- Дата
- Копировал
- Формат А3

### Library data of the parts
C112 = CL10B103KB8NNNC: Конденсатор; Точность: 10%; Напряжение: 16V; Диэлектрик: X7R; Производитель: Samsung Electro-Mechanics; Описание: 10000 pF ±10% 50V Ceramic Capacitor X7R 0603 (1608 Metric); Корпус: 0603 (1608 Metric); Температурный диапазон: -55°C ~ 125°C; Вид монтажа: SMD; Артикул: CL10B103KB8NNNC; Номинал: 10nF; Строка для документации: https://mm.digikey.com/Volume0/opasdata/d220001/medias/docus/609/CL10B103KB8NNNC_Spec.pdf; Тип элемента: Конденсатор
C113 = CL10B104KB8NNNC: as C76 on sheet POWER; Артикул: CL10B104KB8NNNC; Номинал: 0.1uF; Строка для документации: https://mm.digikey.com/Volume0/opasdata/d220001/medias/docus/609/CL10B104KB8NNNC_Spec.pdf; Тип элемента: Конденсатор
DD10 = 74LVC2G17GW,125: as DD7-DD9 on sheet EXT_LED; Артикул: 74LVC2G17GW,125; Строка для документации: https://assets.nexperia.com/documents/data-sheet/74LVC2G17.pdf; Тип элемента: Микросхема
FU25 = MF-MSMF050/40X-2: Плавкий предохранитель; Напряжение: 40V; Тип: PTC Resettable Fuse; Производитель: Bourns Inc.; Описание: Polymeric PTC Resettable Fuse 40V 500 mA Ih Surface Mount 1812 (4532 Metric), Concave; Корпус: 1812 (4532 Metric), Concave; Температурный диапазон: -40°C ~ 85°C; Вид монтажа: SMD; Артикул: MF-MSMF050/40X-2; Ток: 500mA; Строка для документации: https://www.bourns.com/docs/product-datasheets/mf-msmf.pdf; Тип элемента: Предохранитель
HL6 = GNL-0603GC: as HL4 on sheet POWER; Артикул: GNL-0603GC; Строка для документации: https://www.g-nor.com/Uploads/Ed/file/20210517/1621223120713818.doc
R101 = RC0603FR-071K5L: as R67 on sheet POWER; Артикул: RC0603FR-071K5L; Номинал: 1.5k; Строка для документации: https://www.yageo.com/upload/media/product/app/datasheet/rchip/pyu-rc_group_51_rohs_l.pdf; Тип элемента: Резистор
R102 R105 = RC1206FR-074K3L: Резистор; Точность: 1%; ТКС: ±100ppm/°C; Напряжение: 75V; Производитель: YAGEO; Описание: 4.3 kOhms ±1% 0.1W, 1/10W Chip Resistor 0603 (1608 Metric) Moisture Resistant Thick Film; Корпус: 1206 (3216 Metric); Температурный диапазон: -55°C ~ 155°C; Вид монтажа: SMD; Артикул: RC1206FR-074K3L; Номинал: 4.3k; Строка для документации: https://www.yageo.com/upload/media/product/productsearch/datasheet/rchip/PYu-RC_Group_51_RoHS_L_12.pdf; Тип элемента: Резистор
R103 R106 = RC0603FR-0710KL: as R71 on sheet POWER; Артикул: RC0603FR-0710KL; Номинал: 10k; Строка для документации: https://www.yageo.com/upload/media/product/app/datasheet/rchip/pyu-rc_group_51_rohs_l.pdf; Тип элемента: Резистор
R104 = RC0603FR-0733RL: as R95-R99 on sheet EXT_LED; Артикул: RC0603FR-0733RL; Номинал: 33; Строка для документации: https://www.yageo.com/upload/media/product/app/datasheet/rchip/pyu-rc_group_51_rohs_l.pdf; Тип элемента: Резистор
VD33 = PMEG10010ELRX: Диод Шоттки; Прямой ток: 1A; Напряжение: 100V; Производитель: Nexperia USA Inc.; Описание: Diode 100 V 1A Surface Mount SOD-123W; Корпус: SOD-123W; Температурный диапазон: -40°C ~ 175°C; Вид монтажа: SMD; Артикул: PMEG10010ELRX; Тип: Schottky; Строка для документации: https://assets.nexperia.com/documents/data-sheet/PMEG10010ELR.pdf; Тип элемента: Диод
VD34 VD35 = BZT52C4V7-7-F: Стабилитрон; Прямой ток: 5mA; Напряжение: 4.7V; Производитель: Diodes Incorporated; Описание: Zener Diode 4.7 V 500 mW ±6% Surface Mount SOD-123; Корпус: SOD-123; Температурный диапазон: -65°C ~ 150°C; Вид монтажа: SMD; Тип элемента: Диод; Артикул: BZT52C4V7-7-F; Тип: Zener; Строка для документации: https://www.diodes.com/assets/Datasheets/ds18010.pdf
X14 = 15EDGVC-3.5-03P-14-00A(H): Разъем, 3 контакта; Тип разъема: Pluggable terminal block; Количество контактов: 3; Шаг контактов: 3.5mm; Ток: 7A; Напряжение: 250V; Производитель: Degson Electronics; Описание: Pluggable terminal block; 3.5mm; ways: 3; straight; socket; male; Температурный диапазон: -40°C ~ 105°C; Вид монтажа: Through Hole; Артикул: 15EDGVC-3.5-03P-14-00A(H); Строка для документации: https://www.tme.eu/Document/83e7173fe653a2d0e44585e87978945b/opr014R8.pdf; Тип элемента: Разъем

## Nets that join several sheets
+3.3V: MCU (45 pins), DRIVER_A (21 pins), DRIVER_B (20 pins), ABS_ENC_IF (R41.2 R48.2), INC_ENC_IF (C54.2 C59.2 DD4.5 DD5.5), RS_IF (8 pins), POWER (6 pins), EXT_LED (6 pins)
+5V: DRIVER_A (L3.1 X5.4), DRIVER_B (L8.1 X12.4), ABS_ENC_IF (18 pins), INC_ENC_IF (14 pins), POWER (15 pins), SNS_INPUT (C113.2 DD10.5)
+24V: DRIVER_A (X5.7), DRIVER_B (X12.7), POWER (8 pins), EXT_LED (R100.2)
GND: MCU (48 pins), DRIVER_A (45 pins), DRIVER_B (43 pins), ABS_ENC_IF (30 pins), INC_ENC_IF (30 pins), RS_IF (8 pins), POWER (44 pins), EXT_LED (8 pins), SNS_INPUT (9 pins)
24VIN_ADC: MCU (DD1.48), POWER (R61.1 R62.2)
A_I_Common: MCU (DD1.47), DRIVER_A (X5.22)
ABS_ENC_1_CK: MCU (DD1.4), ABS_ENC_IF (DA1.4 R41.1)
ABS_ENC_1_DATA: MCU (DD1.5), ABS_ENC_IF (DA2.2)
ABS_ENC_1_FS: MCU (DD1.3), ABS_ENC_IF (DA1.3 R42.1)
ABS_ENC_2_CK: MCU (DD1.20), ABS_ENC_IF (DA3.4 R48.1)
ABS_ENC_2_DATA: MCU (DD1.2), ABS_ENC_IF (DA4.2)
ABS_ENC_2_FS: MCU (DD1.21), ABS_ENC_IF (DA3.3 R49.1)
B_I_Common: MCU (DD1.49), DRIVER_B (X12.22)
CCW_BTN_1: MCU (DD1.123), SNS_INPUT (R104.1)
CTRL_422_RX: MCU (DD1.122), RS_IF (DA9.3), EXT_LED (DD9.3)
CTRL_422_TX: MCU (DD1.119), RS_IF (DA9.6 R60.1), EXT_LED (DD9.1)
EEPROM_SCL: MCU (DD1.70 R15.2), DRIVER_A (X5.14), DRIVER_B (X12.14)
EEPROM_SDA: MCU (DD1.73 R16.2), DRIVER_A (X5.15), DRIVER_B (X12.15)
INC_ENC_1_A: DRIVER_A (DD2.35), INC_ENC_IF (R53.2)
INC_ENC_1_B: DRIVER_A (DD2.34), INC_ENC_IF (R52.2)
INC_ENC_2_A: DRIVER_B (DD6.35), INC_ENC_IF (R57.2)
INC_ENC_2_B: DRIVER_B (DD6.34), INC_ENC_IF (R56.2)
MCU_LED1: MCU (DD1.127 HL1.1), EXT_LED (DD7.1)
MCU_LED2: MCU (DD1.129 HL2.1), EXT_LED (DD7.3)
MCU_LED3: MCU (DD1.132 HL3.1), EXT_LED (DD8.1)
MCU_nRST: MCU (C3.2 DD1.25 R11.2 X1.15), DRIVER_A (R36.2), DRIVER_B (R94.2), POWER (R70.2)
T_SENSE_A_1: MCU (DD1.28), DRIVER_A (X5.29)
T_SENSE_A_2: MCU (DD1.29), DRIVER_A (X5.30)
T_SENSE_B_1: MCU (DD1.54), DRIVER_B (X12.29)
T_SENSE_B_2: MCU (DD1.53), DRIVER_B (X12.30)
TMC_A_CS: MCU (DD1.40), DRIVER_A (DD2.6 R24.1)
TMC_A_DIR: MCU (DD1.82), DRIVER_A (DD2.56 R33.1)
TMC_A_EN: MCU (DD1.87), DRIVER_A (DD2.55 R30.1)
TMC_A_MISO: MCU (DD1.112), DRIVER_A (DD2.9 R26.1)
TMC_A_MOSI: MCU (DD1.113), DRIVER_A (DD2.8)
TMC_A_RX: MCU (DD1.141), DRIVER_A (DD2.11 R29.1)
TMC_A_SCK: MCU (DD1.111), DRIVER_A (DD2.7)
TMC_A_STAT: MCU (DD1.86), DRIVER_A (DD2.12)
TMC_A_STEP: MCU (DD1.85), DRIVER_A (DD2.57 R32.1)
TMC_A_TX: MCU (DD1.142), DRIVER_A (DD2.10 R28.1)
TMC_B_CLK: DRIVER_A (R20.1), DRIVER_B (DD6.51)
TMC_B_CS: MCU (DD1.110 R14.2), DRIVER_B (DD6.6 R82.1)
TMC_B_DIR: MCU (DD1.81), DRIVER_B (DD6.56 R91.1)
TMC_B_EN: MCU (DD1.88), DRIVER_B (DD6.55 R88.1)
TMC_B_MISO: MCU (DD1.42), DRIVER_B (DD6.9 R84.1)
TMC_B_MOSI: MCU (DD1.135), DRIVER_B (DD6.8)
TMC_B_RX: MCU (DD1.97), DRIVER_B (DD6.11 R87.1)
TMC_B_SCK: MCU (DD1.41), DRIVER_B (DD6.7)
TMC_B_STAT: MCU (DD1.79), DRIVER_B (DD6.12)
TMC_B_STEP: MCU (DD1.80), DRIVER_B (DD6.57 R90.1)
TMC_B_TX: MCU (DD1.96), DRIVER_B (DD6.10 R86.1)
VM_A_DIV: MCU (DD1.46), DRIVER_A (C25.2 DD2.20 X5.28)
VM_B_DIV: MCU (DD1.50), DRIVER_B (C91.2 DD6.20 X12.28)